# Altium schematic sheet Power.SchDoc
size A4
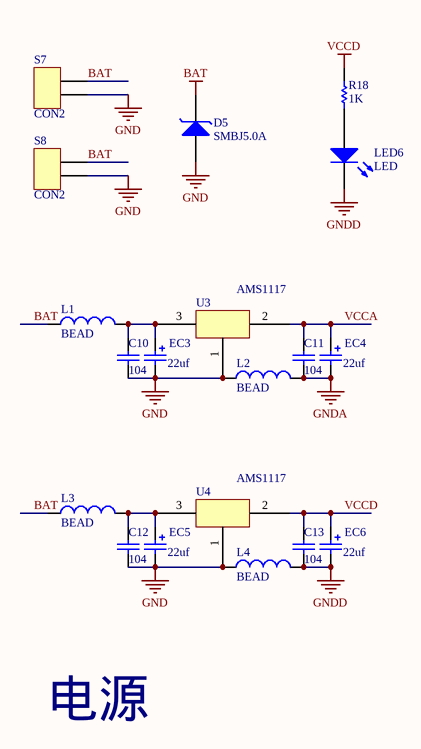
[diagram p0: Power.SchDoc]

## Parts
C10  104  [0603]
C11  104  [0603]
C12  104  [0603]
C13  104  [0603]
D5  SMBJ5.0A  [DIOM4436X23N]
EC3  22uf  [1206]
EC4  22uf  [1206]
EC5  22uf  [1206]
EC6  22uf  [1206]
L1  BEAD  [0805]
L2  BEAD  [0805]
L3  BEAD  [0805]
L4  BEAD  [0805]
LED6  LED  [0805]
R18  1K  [0603]
S7  CON2  [SIP2]
S8  CON2  [1206]
U3  AMS1117  [SOT223]
U4  AMS1117  [SOT223]

## Nets
BAT: D5.2(K) L1.1 L3.1 S7.1 S8.1
GND: C10.2 C12.2 D5.1(A) EC3.2 EC5.2 L2.1 L4.1 S7.2 S8.2 U3.1 U4.1
GNDA: C11.2 EC4.2 L2.2
GNDD: C13.2 EC6.2 L4.2 LED6.2(K)
VCCD: C13.1 EC6.1 R18.1 U4.2
VCCA: C11.1 EC4.1 U3.2
NetC10_1: C10.1 EC3.1 L1.2 U3.3
NetC12_1: C12.1 EC5.1 L3.2 U4.3
NetLED6_1: LED6.1(A) R18.2

Not connected (* = marked no-connect by the designer): U3 4; U4 4

## Notes on the sheet
- 电源

## Library data of the parts
C10-C13 = CAP
EC3-EC6 = EC
L1-L4 = Inductor: Code_IEC: 1005; Published: 8-Jun-2000; LatestRevisionDate: 29-May-2009; LatestRevisionNote: IPC-7351 Footprint Added.; PackageReference: 0402-A; Publisher: Altium Limited; PackageDescription: Chip Inductor; Code_JEITA: 0402
R18 = RES